# EAGLE design IOBoard (EAGLE 6.6.0)
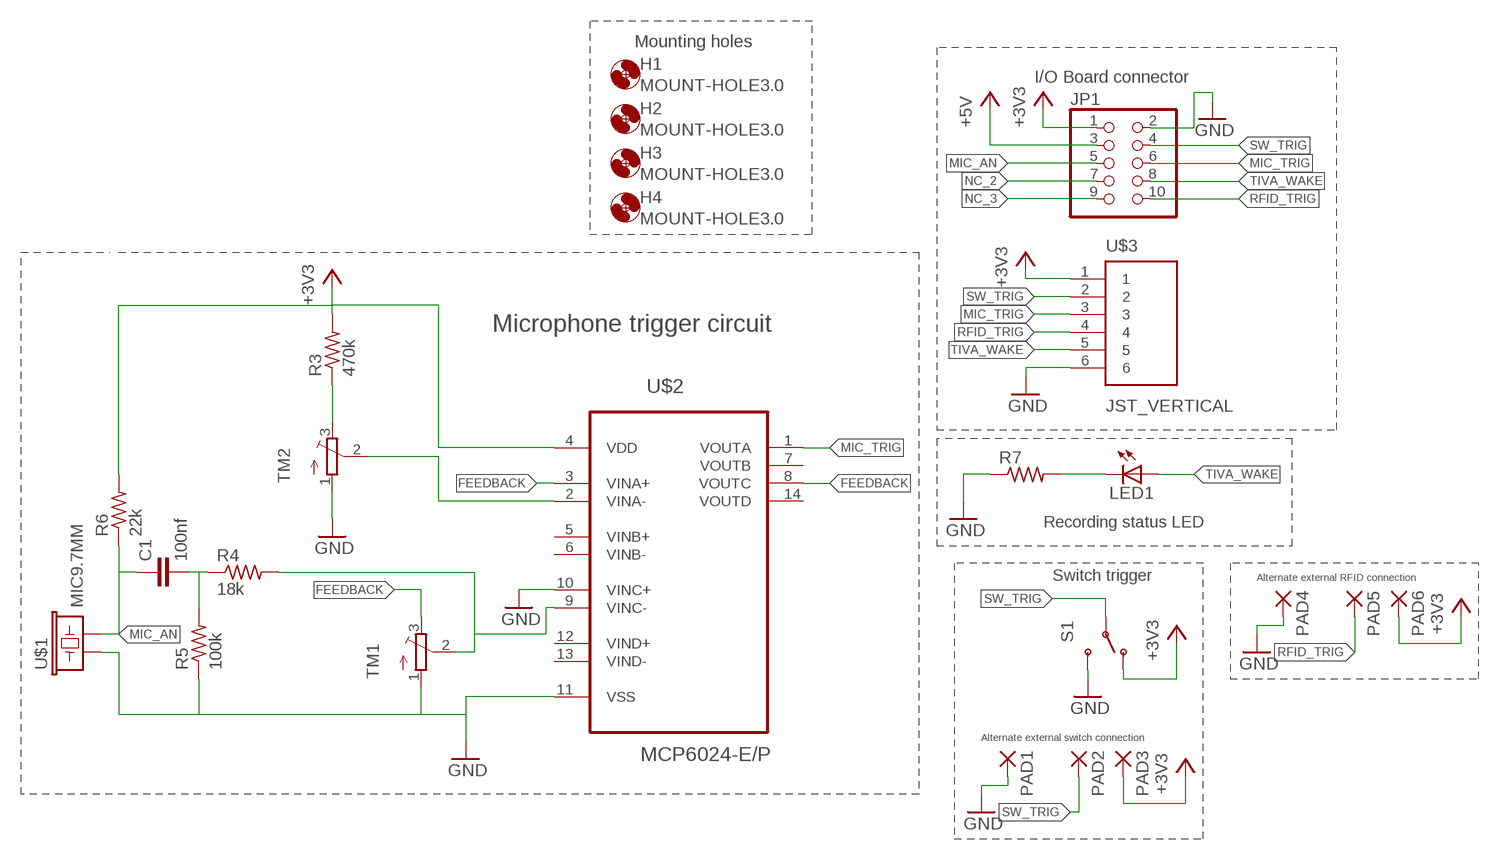
[diagram p0: schematic, sheet 1]

## Parts
C1  100nf  C-EUC0603  [C0603]
H1  MOUNT-HOLE3.0  [3,0]
H2  MOUNT-HOLE3.0  [3,0]
H3  MOUNT-HOLE3.0  [3,0]
H4  MOUNT-HOLE3.0  [3,0]
JP1  PINHD-2X5  [2X05]
LED1  LED10MM  [LED10MM]
PAD1  2,54/1,0  [2,54/1,0]
PAD2  2,54/1,0  [2,54/1,0]
PAD3  2,54/1,0  [2,54/1,0]
PAD4  2,54/1,0  [2,54/1,0]
PAD5  2,54/1,0  [2,54/1,0]
PAD6  2,54/1,0  [2,54/1,0]
R3  470k  R-US_R0603  [R0603]
R4  18k  R-US_R0603  [R0603]
R5  100k  R-US_R0603  [R0603]
R6  22k  R-US_R0603  [R0603]
R7  R-US_R0603  [R0603]
S1  SWITCH-SPDTPTH  [SWITCH-SPDT]
TM1  TRIMPOTTC33X  [TC33X]
TM2  TRIMPOTTC33X  [TC33X]
U$1  MIC9.7MM  [MIC-9.7MM]
U$2  MCP6024-E/P  [DIP254P762X533-14]
U$3  JST_VERTICAL  [JST-6-SMD-VERT-1.0MM]

## Nets
+3V3: JP1.1 PAD3.1(P) PAD6.1(P) R3.2 R6.2 S1.1(O) U$2.4(VDD) U$3.1
+5V: JP1.3
FEEDBACK: TM1.3(E) U$2.3(VINA+) U$2.8(VOUTC)
GND: JP1.2 PAD1.1(P) PAD4.1(P) R5.1 R7.1 S1.3(S) TM1.1(A) TM2.1(A) U$1.1 U$2.10(VINC+) U$2.11(VSS) U$3.6
MIC_AN: C1.1 JP1.5 R6.1 U$1.2
MIC_TRIG: JP1.6 U$2.1(VOUTA) U$3.3
N$1: R4.2 TM1.2(S) U$2.9(VINC-)
N$2: TM2.2(S) U$2.2(VINA-)
N$3: R3.1 TM2.3(E)
N$4: LED1.K(C) R7.2
N$6: C1.2 R4.1 R5.2
NC_2: JP1.7
NC_3: JP1.9
RFID_TRIG: JP1.10 PAD5.1(P) U$3.4
SW_TRIG: JP1.4 PAD2.1(P) S1.2(P) U$3.2
TIVA_WAKE: JP1.8 LED1.A U$3.5
Unconnected: U$2.5(VINB+) U$2.6(VINB-) U$2.7(VOUTB) U$2.12(VIND+) U$2.13(VIND-) U$2.14(VOUTD)

## Notes on the sheet
- Mounting holes
- I/O Board connector
- Microphone trigger circuit
- Recording status LED
- Switch trigger | Alternate external RFID connection
- Alternate external switch connection

## Library data of the parts
C1 = rcl:C-EU: CAPACITOR, European symbol
H1-H4 = holes:MOUNT-HOLE: MOUNTING HOLE with drill center marker
JP1 = pinhead:PINHD-2X5: PIN HEADER
LED1 = led:LED: LED OSRAM: - CHIPLED LG R971, LG N971, LY N971, LG Q971, LY Q971, LO R971, LY R971 LH N974, LH R974 LS Q976, LO Q976, LY Q976 LO Q996 - Hyper CHIPLED LW Q18S LB Q993, LB Q99A, LB R99A - SideLED LS A670, LO A670, LY A670, LG A670, LP A670 LB A673, LV A673, LT A673, LW A673 LH A674 LY A675 LS A676, LA A676, LO A676, LY A676, LW A676 LS A679, LY A679, LG A679 - Hyper Micro SIDELEDÂ® LS Y876, LA Y876, LO Y876, LY Y876 LT Y87S - SmartLED LW L88C, LW L88S LB L89C, LB L89S, LG L890 LS L89K, LO L89K, LY L89K LS L896, LA L896, LO L896, LY L896 - TOPLED LS T670, LO T670, LY T670, LG T670, LP T670 LSG T670, LSP T670, LSY T670, LOP T670, LYG T670 LG T671, LOG T671, LSG T671 LB T673, LV T673, LT T673, LW T673 LH T674 LS T676, LA T676, LO T676, LY T676, LB T676, LH T676, LSB T676, LW T676 LB T67C, LV T67C, LT T67C, LS T67K, LO T67K, LY T67K, LW E67C LS E67B, LA E67B, LO E67B, LY E67B, LB E67C, LV E67C, LT E67C LW T67C LS T679, LY T679, LG T679 LS T770, LO T770, LY T770, LG T770, LP T770 LB T773, LV T773, LT T773, LW T773 LH T774 LS E675, LA E675, LY E675, LS T675 LS T776, LA T776, LO T776, LY T776, LB T776 LHGB T686 LT T68C, LB T68C - Hyper Mini TOPLEDÂ® LB M676 - Mini TOPLED SantanaÂ® LG M470 LS M47K, LO M47K, LY M47K Source: http://www.osram.convergy.de LUXEON: - LUMILEDÂ® LXK2-PW12-R00, LXK2-PW12-S00, LXK2-PW14-U00, LXK2-PW14-V00 LXK2-PM12-R00, LXK2-PM12-S00, LXK2-PM14-U00 LXK2-PE12-Q00, LXK2-PE12-R00, LXK2-PE12-S00, LXK2-PE14-T00, LXK2-PE14-U00 LXK2-PB12-K00, LXK2-PB12-L00, LXK2-PB12-M00, LXK2-PB14-N00, LXK2-PB14-P00, LXK2-PB14-Q00 LXK2-PR12-L00, LXK2-PR12-M00, LXK2-PR14-Q00, LXK2-PR14-R00 LXK2-PD12-Q00, LXK2-PD12-R00, LXK2-PD12-S00 LXK2-PH12-R00, LXK2-PH12-S00 LXK2-PL12-P00, LXK2-PL12-Q00, LXK2-PL12-R00 Source: www.luxeon.com KINGBRIGHT: KA-3528ASYC Source: www.kingbright.com
PAD1-PAD6 = wirepad:2,54/1,0: THROUGH-HOLE PAD
R3-R7 = rcl:R-US_: RESISTOR, American symbol
S1 = SparkFun-Electromechanical:SWITCH-SPDT: SPDT Switch Simple slide switch, Spark Fun Electronics SKU : COM-00102 DPDT SMT slide switch, AYZ0202, SWCH-08179; PROD_ID: SWCH-08261
TM1 TM2 = adafruit:TRIMPOT: SMT trimmer potentiometer part number TC33X http://www.ladyada.net/library/eagle
U$1 = SparkFun-Sensors:MIC: Omni-directional electret microphone. 9.7mm standard diameter.; PROD_ID: COMP-08856
U$2 = Microchip_By_element14_Batch_1:MCP6024-E/P: Op Amp; MPN: MCP6024-E/P; OC_FARNELL: 1332127; OC_NEWARK: 34M7479; PACKAGE: DIP-14; SUPPLIER: Microchip
U$3 = SparkFun-Connectors:JST_VERTICAL; PROD_ID: CONN-08249

## Board
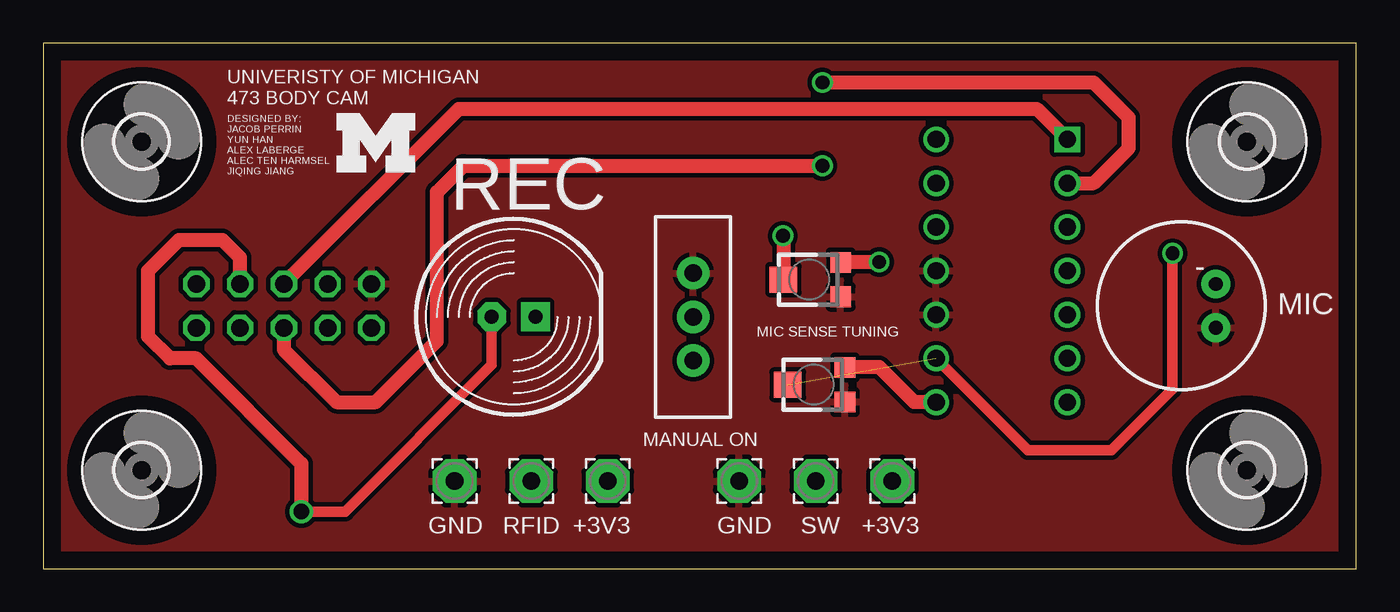
[diagram p1: board, top side]
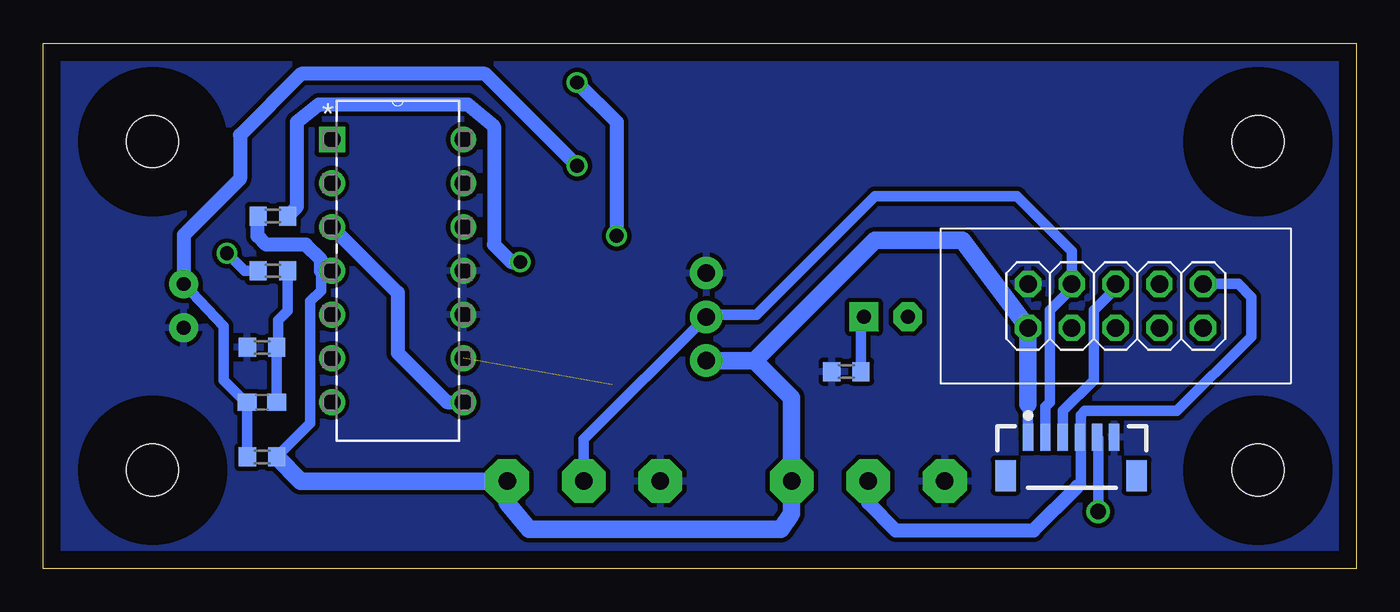
[diagram p2: board, bottom side, seen from below]

Size 76.2 x 30.48 mm. Coordinates in mm from the lower left corner, seen from the top.
Outline: 0,0 76.2,0 76.2,30.48 0,30.48 0,0
Copper layers (1*16): Top 0.035mm / dielectric 1.5mm / Bottom 0.035mm
Design rules "default": minimum track width 10mil, minimum drill 24mil, track to track 8mil, track to pad 8mil, pad to pad 8mil, via to via 8mil, smd to smd 8mil, copper to edge 40mil, drill to drill 8mil, minimum pad ring 10mil, minimum via ring 8mil, stop-mask expansion 4mil, vias tented up to drill 0mil, thermal gap 10mil

### Footprints (pad centres in the part's own frame; a part is rotated, then mirrored left to right if it is on the bottom)
C0603 = smd 1.1 x 1: 1 -0.85,0; 2 0.85,0
3,0 = hole 3: 0,0
2X05 = drill 1.016 octagon: 1 -5.08,-1.27; 2 -5.08,1.27; 3 -2.54,-1.27; 4 -2.54,1.27; 5 0,-1.27; 6 0,1.27; 7 2.54,-1.27; 8 2.54,1.27; 9 5.08,-1.27; 10 5.08,1.27
LED10MM = drill 0.813 pad 1.676 octagon: A -1.27,0 | drill 0.813 pad 1.676 square: K 1.27,0
2,54/1,0 = drill 1.016 pad 2.54 octagon: 1 0,0
R0603 = smd 1 x 1.1: 1 -0.85,0; 2 0.85,0
SWITCH-SPDT = drill 1.016 pad 1.88: 1 0,2.54; 2 0,0; 3 0,-2.54
TC33X = smd 1.2 x 1.2: 1 -1,-1.825; 3 1,-1.825 | smd 1.5 x 1.6: 2 0,1.5
MIC-9.7MM = drill 0.8 pad 1.676: 1 -2,1.27; 2 -2,-1.27
DIP254P762X533-14 = drill 0.991 square: 1 -7.62,15.24 | drill 0.991: 2 -7.62,12.7; 3 -7.62,10.16; 4 -7.62,7.62; 5 -7.62,5.08; 6 -7.62,2.54; 7 -7.62,0; 8 0,0; 9 0,2.54; 10 0,5.08; 11 0,7.62; 12 0,10.16; 13 0,12.7; 14 0,15.24
JST-6-SMD-VERT-1.0MM = smd 0.6 x 1.55: 1 -2.54,1.27; 2 -1.54,1.27; 3 -0.54,1.27; 4 0.46,1.27; 5 1.46,1.27; 6 2.46,1.27 | smd 1.2 x 1.8: P$1 -3.84,-0.955; P$2 3.76,-0.955

### Placement (x,y rotation side)
C1  63.5,9.65 0 bottom
H1  5.71,24.77 0 top
H2  69.85,24.77 0 top
H3  69.85,5.71 0 top
H4  5.71,5.71 0 top
JP1  13.97,15.24 0 bottom
LED1  27.3,14.61 0 top
PAD1  40.39,5.08 0 top
PAD2  44.83,5.08 0 top
PAD3  49.28,5.08 0 top
PAD4  23.88,5.08 0 top
PAD5  28.32,5.08 0 top
PAD6  32.77,5.08 0 top
R3  62.87,20.45 180 bottom
R4  62.87,17.27 180 bottom
R5  63.5,12.83 0 bottom
R6  63.5,6.48 0 bottom
R7  29.59,11.43 0 bottom
S1  37.72,14.61 180 top
TM1  44.7,10.67 90 top
TM2  44.45,16.76 90 top
U$1  66.04,15.24 180 top
U$2  51.82,9.65 0 bottom
U$3  16.51,6.35 0 bottom
U$4  [BLOCK-M-5MM]  19.3,24.64 0 top

### Tracks (layer width: path | path; a pad name or v marks a point on that pad's centre or on a via)
+3V3
  Bottom 0.61: 19.05,9.53 U$3.1 | R6.2 60.71,8.42 60.71,15.49 60.07,16.13 60.07,17.27 U$2.4
  Bottom 0.813: 60.07,17.27 60.07,17.91 60.96,18.8 63.25,18.8 63.75,19.3 63.75,20.41 R3.2
  Bottom 1.016: 19.05,9.53 JP1.1 22.86,19.05 27.94,19.05 34.92,12.06 | S1.1 34.92,12.06 | R6.2 61.25,5.08 PAD3.1 49.28,3.81 48.01,2.29 33.4,2.29 32.77,3.17 PAD6.1 32.77,9.91 34.92,12.06
FEEDBACK
  Top 0.813: U$2.8 50.55,9.65 48.51,11.68 46.55,11.68 TM1.3
  Bottom 0.813: U$2.3 55.63,16 55.63,12.51 52.77,9.65 U$2.8
GND
  pour Top (isolate 0.254): -5.08,102.87 167.64,102.87 167.64,-7.62 -5.08,-7.62
  pour Bottom (isolate 0.254): -10.16,110.49 181.61,110.49 181.61,-17.78 -16.51,-17.78 -16.51,110.49
MIC_AN  (via drill 0.8)
  Top 0.813: JP1.5 13.97,12.7 17.02,9.65 19.3,9.65 22.86,13.21 22.86,21.84 24.38,23.37 v45.21,23.37
  Bottom 0.61: R6.1 C1.1 64.45,9.65 65.72,10.92 65.72,14.07 U$1.2
  Bottom 0.813: U$1.2 68.04,19.34 64.77,22.61 64.77,25.15 61.21,28.7 50.55,28.7 v45.21,23.37
MIC_TRIG
  Top 0.813: JP1.6 24.13,26.67 57.66,26.67 U$2.1
  Bottom 0.61: JP1.6 13.97,16.26 15.24,14.99 15.24,10.92 17.02,9.14 17.02,7.65 U$3.3
N$1  (via drill 0.8)  (1 unrouted)
  Top 0.61: U$2.9 57.15,6.86 61.98,6.86 65.53,10.41 v65.53,18.29
  Bottom 0.61: v65.53,18.29 64.52,17.27 R4.2
N$2  (via drill 0.8)
  Top 0.813: U$2.2 60.96,22.35 62.99,24.38 62.99,26.16 60.96,28.19 v45.21,28.19 | v42.93,19.3 42.95,19.28 TM2.2
  Bottom 0.813: v45.21,28.19 42.93,25.91 v42.93,19.3
N$3  (via drill 0.8)
  Top 0.813: v48.51,17.78 48.5,17.76 TM2.3
  Bottom 0.813: R3.1 61.47,20.99 61.47,25.91 60.2,26.92 51.56,26.92 50.04,25.65 50.04,18.8 49.02,17.78 v48.51,17.78
N$4
  Bottom 0.61: R7.2 28.74,14.44 LED1.K
N$6
  Bottom 0.61: C1.2 R5.2 62.55,12.93 62.55,14.41 62.02,14.95 R4.1
RFID_TRIG
  Bottom 0.61: 16.19,4.76 16.07,4.76 16,4.83 16,7.57 U$3.4 16,7.67 16,8.89 15.75,9.14 10.41,9.14 6.1,13.46 6.1,15.75 6.86,16.51 JP1.10
  Bottom 0.813: PAD5.1 28.32,3.81 26.73,2.22 18.73,2.22 16.19,4.76
SW_TRIG
  Bottom 0.61: U$3.2 18.03,7.64 18.03,9.4 17.78,9.65 17.78,14.99 16.51,16.26 JP1.4 16.51,18.41 19.68,21.59 27.94,21.59 34.8,14.73 37.59,14.73 S1.2 44.83,7.49 PAD2.1 44.83,5.71
TIVA_WAKE  (via drill 0.9)
  Top 0.61: v14.99,3.3 17.53,3.3 26.04,11.81 LED1.A
  Top 0.813: JP1.8 11.43,18.03 10.41,19.05 7.87,19.05 6.1,17.27 6.1,13.46 7.37,12.19 8.89,12.19 14.99,6.1 v14.99,3.3
  Bottom 0.61: v14.99,3.3 14.99,7.56 U$3.5

### Text on the board
tPlace: UNIVERISTY OF MICHIGAN / 473 BODY CAM | DESIGNED BY: / JACOB PERRIN / YUN HAN / ALEX LABERGE / ALEC TEN HARMSEL / JIQING JIANG | REC | MIC | MIC SENSE TUNING | MANUAL ON | GND | RFID | +3V3 | GND | SW | +3V3